# Altium schematic sheet TSynth.schDoc
size A4; Organization: Altium Limited; Address1: L3, 12a Rodborough Rd; Address2: Frenchs Forest; Address3: NSW; Address4: Australia 2086; DocumentNumber: 19; SheetNumber: 19; SheetTotal: 22
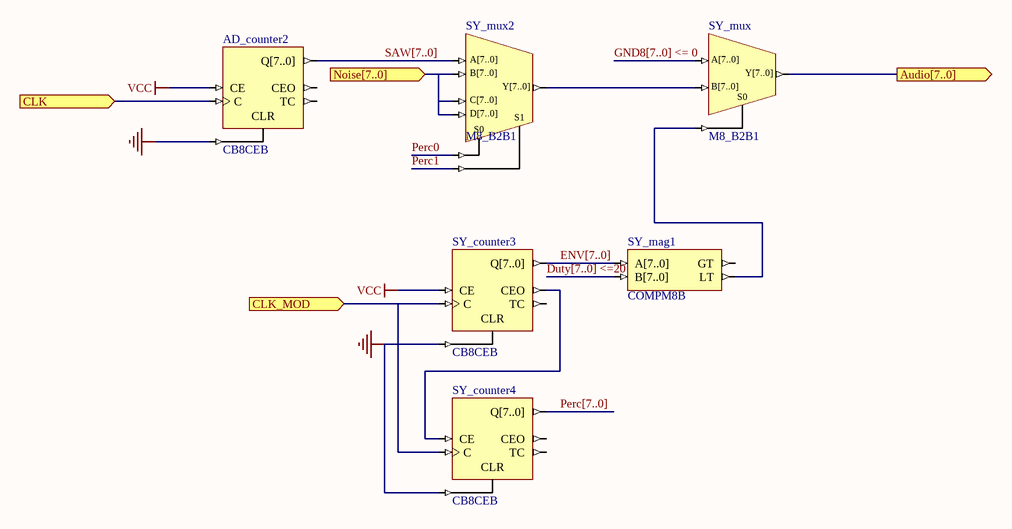
[diagram p0: TSynth.schDoc]

## Parts
AD_counter2  CB8CEB
SY_counter3  CB8CEB
SY_counter4  CB8CEB
SY_mag1  COMPM8B
SY_mux  M8_B2B1
SY_mux2  M8_B2B1

## Ports
Audio[7..0] (out), CLK (in), CLK_MOD (in), Noise[7..0] (in)

## Nets
GND: AD_counter2.CLR SY_counter3.CLR SY_counter4.CLR
VCC: AD_counter2.CE SY_counter3.CE
Audio[7..0]: SY_mux.Y[7..0] ; port Audio[7..0]
CLK: AD_counter2.C ; port CLK
CLK_MOD: SY_counter3.C SY_counter4.C ; port CLK_MOD
Duty[7..0] <=20: SY_mag1.B[7..0]
ENV[7..0]: SY_counter3.Q[7..0] SY_mag1.A[7..0]
GND8[7..0] <= 0: SY_mux.A[7..0]
Noise[7..0]: SY_mux2.B[7..0] SY_mux2.C[7..0] SY_mux2.D[7..0] ; port Noise[7..0]
Perc0: SY_mux2.S0
Perc1: SY_mux2.S1
Perc[7..0]: SY_counter4.Q[7..0]
SAW[7..0]: AD_counter2.Q[7..0] SY_mux2.A[7..0]
NetSY_counter3_CEO: SY_counter3.CEO SY_counter4.CE
NetSY_mag1_LT: SY_mag1.LT SY_mux.S0
NetSY_mux_B[7..0]: SY_mux.B[7..0] SY_mux2.Y[7..0]

Not connected (* = marked no-connect by the designer): AD_counter2 CEO TC; SY_counter3 TC; SY_counter4 CEO TC; SY_mag1 GT

## Buses and harness runs
bus Duty[7..0] <=20
bus ENV[7..0]
bus GND8[7..0] <= 0
bus Perc[7..0]
bus SAW[7..0]

## Notes on the sheet
- Title
- Size:
- Date:
- A4
- Number:
- Time:
- Revision:
- Sheet
- of
- File:

## Library data of the parts
AD_counter2 SY_counter3 SY_counter4 = CB8CEB: 8-Bit Cascadable Binary Counters with Clock Enable and Asynchronous Clear, Bus Version; Xilinx Equivalent: CB8CE; ArchiveName: GENERIC; Published: 9-30-2003; Publisher: Altium Limited; Core Revision: 1.00.00
SY_mag1 = COMPM8B: 8-Bit Magnitude Comparator, Bus Version; Xilinx Equivalent: COMPM8; ArchiveName: GENERIC; Published: 9-30-2003; Publisher: Altium Limited; Core Revision: 1.00.00
SY_mux = M8_B2B1: 2x8-Bit Bus to 1x8-Bit Bus Multiplexer; ArchiveName: GENERIC; Published: 9-30-2003; Publisher: Altium Limited; Core Revision: 1.00.00
SY_mux2 = M8_B4B1: 4x8-Bit Bus to 1x8-Bit Bus Multiplexer; ArchiveName: GENERIC; Published: 9-30-2003; Publisher: Altium Limited; Core Revision: 1.00.00